# Altium schematic sheet Pedal.SchDoc
size A4
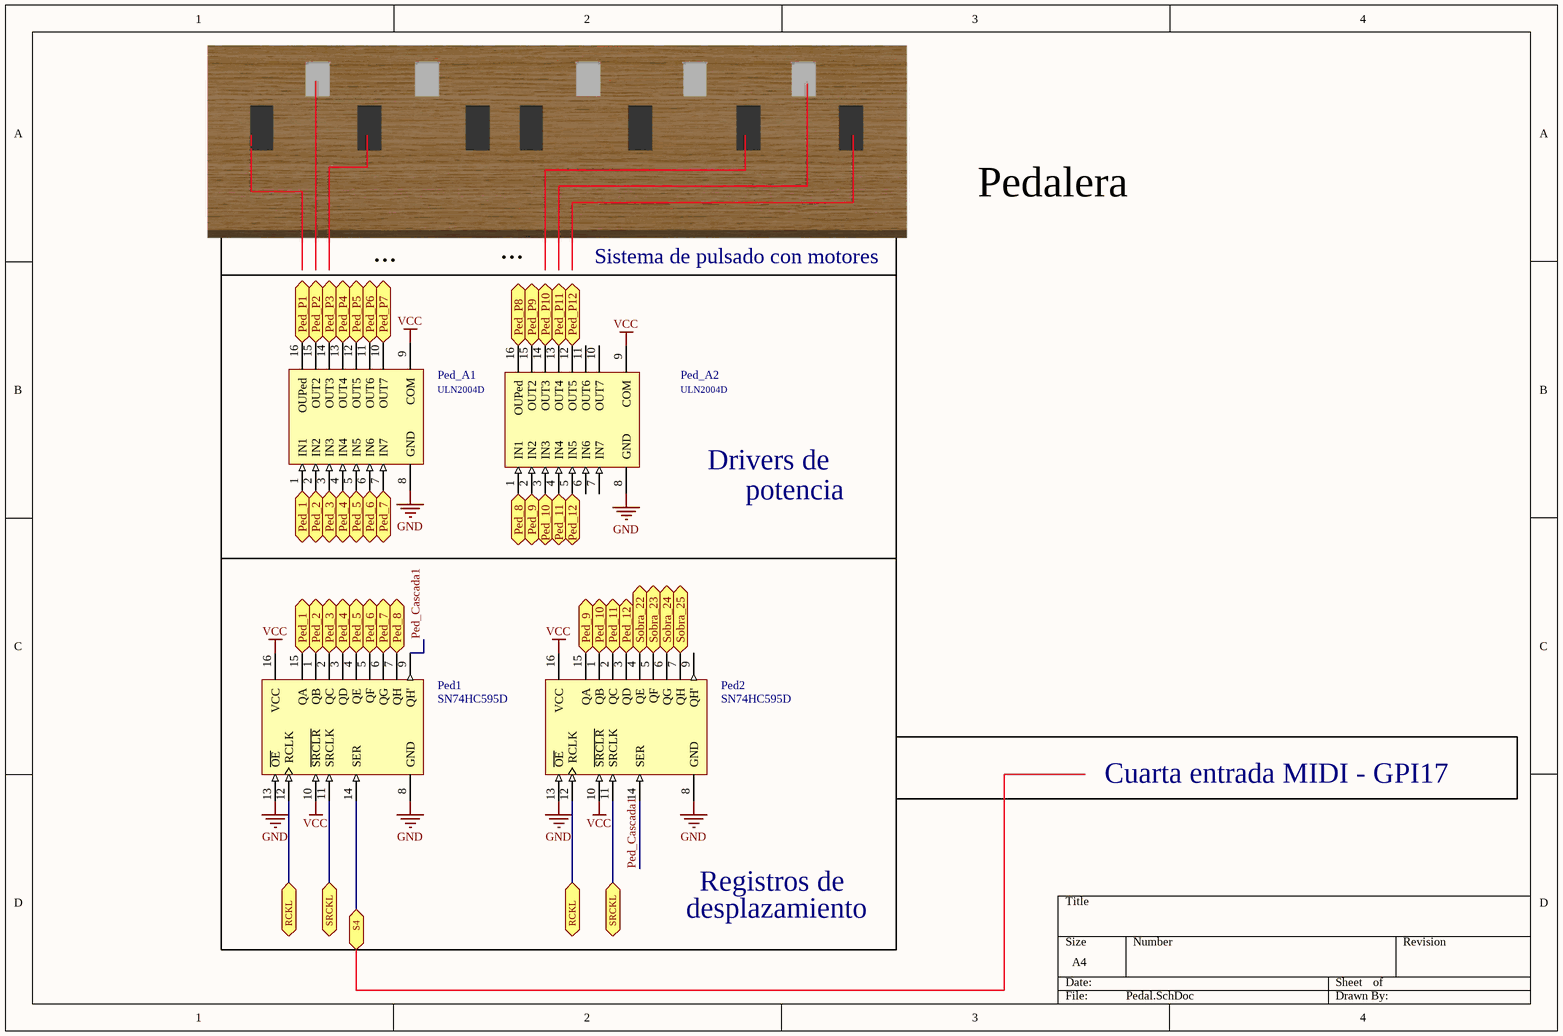
[diagram p0: Pedal.SchDoc]

## Parts
Ped1  SN74HC595D  [D016_N]
Ped2  SN74HC595D  [D016_N]
Ped_A1  ULN2004D  [SO16_N]
Ped_A2  ULN2004D  [SO16_N]

## Ports
Ped_1, Ped_2, Ped_3, Ped_4, Ped_5, Ped_6, Ped_7, Ped_8, Ped_9, Ped_10, Ped_11, Ped_12, Ped_P1, Ped_P2, Ped_P3, Ped_P4, Ped_P5, Ped_P6, Ped_P7, Ped_P8, Ped_P9, Ped_P10, Ped_P11, Ped_P12, RCKL, S4, Sobra_22, Sobra_23, Sobra_24, Sobra_25, SRCKL

## Nets
GND: Ped1.8(GND) Ped1.13(~{OE}) Ped2.8(GND) Ped2.13(~{OE}) Ped_A1.8(GND) Ped_A2.8(GND)
VCC: Ped1.10(~{SRCLR}) Ped1.16(VCC) Ped2.10(~{SRCLR}) Ped2.16(VCC) Ped_A1.9(COM) Ped_A2.9(COM)
Ped_1: Ped1.15(QA) Ped_A1.1(IN1) ; port Ped_1
Ped_2: Ped1.1(QB) Ped_A1.2(IN2) ; port Ped_2
Ped_3: Ped1.2(QC) Ped_A1.3(IN3) ; port Ped_3
Ped_4: Ped1.3(QD) Ped_A1.4(IN4) ; port Ped_4
Ped_5: Ped1.4(QE) Ped_A1.5(IN5) ; port Ped_5
Ped_6: Ped1.5(QF) Ped_A1.6(IN6) ; port Ped_6
Ped_7: Ped1.6(QG) Ped_A1.7(IN7) ; port Ped_7
Ped_8: Ped1.7(QH) Ped_A2.1(IN1) ; port Ped_8
Ped_9: Ped2.15(QA) Ped_A2.2(IN2) ; port Ped_9
Ped_10: Ped2.1(QB) Ped_A2.3(IN3) ; port Ped_10
Ped_11: Ped2.2(QC) Ped_A2.4(IN4) ; port Ped_11
Ped_12: Ped2.3(QD) Ped_A2.5(IN5) ; port Ped_12
Ped_Cascada1: Ped1.9(QH') Ped2.14(SER)
Ped_P1: Ped_A1.16(OUPed) ; port Ped_P1
Ped_P2: Ped_A1.15(OUT2) ; port Ped_P2
Ped_P3: Ped_A1.14(OUT3) ; port Ped_P3
Ped_P4: Ped_A1.13(OUT4) ; port Ped_P4
Ped_P5: Ped_A1.12(OUT5) ; port Ped_P5
Ped_P6: Ped_A1.11(OUT6) ; port Ped_P6
Ped_P7: Ped_A1.10(OUT7) ; port Ped_P7
Ped_P8: Ped_A2.16(OUPed) ; port Ped_P8
Ped_P9: Ped_A2.15(OUT2) ; port Ped_P9
Ped_P10: Ped_A2.14(OUT3) ; port Ped_P10
Ped_P11: Ped_A2.13(OUT4) ; port Ped_P11
Ped_P12: Ped_A2.12(OUT5) ; port Ped_P12
RCKL: Ped1.12(RCLK) Ped2.12(RCLK) ; port RCKL
S4: Ped1.14(SER) ; port S4
Sobra_22: Ped2.4(QE) ; port Sobra_22
Sobra_23: Ped2.5(QF) ; port Sobra_23
Sobra_24: Ped2.6(QG) ; port Sobra_24
Sobra_25: Ped2.7(QH) ; port Sobra_25
SRCKL: Ped1.11(SRCLK) Ped2.11(SRCLK) ; port SRCKL

Not connected (* = marked no-connect by the designer): Ped2 9(QH'); Ped_A2 6(IN6) 7(IN7) 10(OUT7) 11(OUT6)

## Notes on the sheet
- Pedalera
- ...
- Sistema de pulsado con motores
- Drivers de
- potencia
- Cuarta entrada MIDI - GPI17
- desplazamiento
- Registros de

## Library data of the parts
Ped1 Ped2 = SN74HC595D: 8-Bit Shift Register with 3-State Output Registers; Published: 8-Jun-2000; LatestRevisionDate: 13-Apr-2006; LatestRevisionNote: IPC-7351 Footprint Added.; DatasheetVersion: May-1997; PackageVersion: Jan-1998; PackageReference: D016; Publisher: Altium Limited; PackageDescription: 16-Pin Small Outline Integrated Circuit 1.27 mm Pitch; Code_IPC: SOIC127P600-16; ComponentLink1Description: Manufacturer Link; ComponentLink1URL: http://www.ti.com/; ComponentLink2Description: Datasheet; ComponentLink2URL: http://www-s.ti.com/sc/ds/sn74hc595.pdf
Ped_A1 Ped_A2 = ULN2004D: Seven Darlington Array; Published: 8-Jun-2000; LatestRevisionDate: 13-Apr-2006; LatestRevisionNote: IPC-7351 Footprint Added.; DatasheetVersion: Sep-1998; PackageVersion: May-1998; PackageReference: SO16; Publisher: Altium Limited; PackageDescription: 16-Pin Small Outline Integrated Circuit 1.27 mm Pitch; Code_IPC: SOIC127P600-16; ComponentLink1Description: Manufacturer Link; ComponentLink1URL: http://www.st.com/; ComponentLink2Description: Datasheet; ComponentLink2URL: http://www.st.com/stonline/products/literature/ds/5279/uln2001.pdf